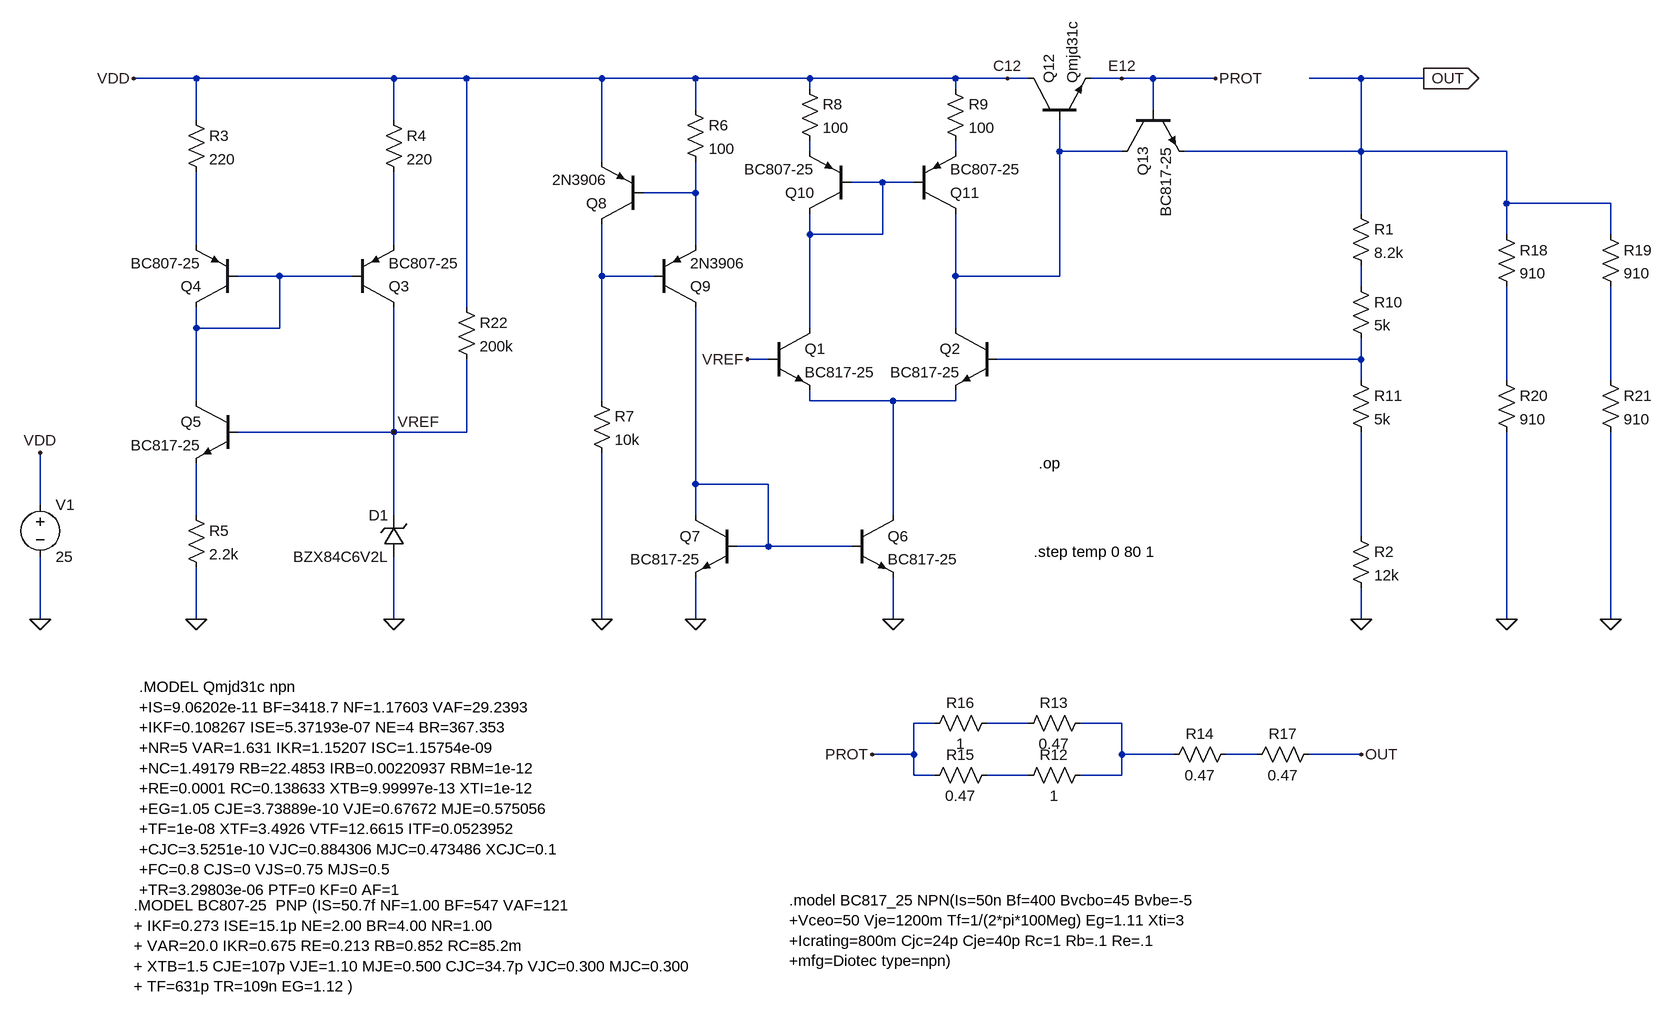
[diagram p0: schematic THERMAL_DRIFT.asc]
THERMAL_DRIFT.asc, the LTspice schematic file:
Version 4
SHEET 1 1236 776
WIRE -1008 -624 -1104 -624
WIRE -704 -624 -1008 -624
WIRE -592 -624 -704 -624
WIRE -384 -624 -592 -624
WIRE -240 -624 -384 -624
WIRE -64 -624 -240 -624
WIRE 160 -624 -64 -624
WIRE 240 -624 160 -624
WIRE 272 -624 240 -624
WIRE 416 -624 368 -624
WIRE 464 -624 416 -624
WIRE 560 -624 464 -624
WIRE 784 -624 704 -624
WIRE 880 -624 784 -624
WIRE -64 -608 -64 -624
WIRE 160 -608 160 -624
WIRE -240 -576 -240 -624
WIRE 464 -576 464 -624
WIRE -1008 -560 -1008 -624
WIRE -704 -560 -704 -624
WIRE -64 -512 -64 -528
WIRE 160 -512 160 -528
WIRE 320 -512 320 -560
WIRE 416 -512 320 -512
WIRE 784 -512 784 -624
WIRE 784 -512 512 -512
WIRE 1008 -512 784 -512
WIRE -384 -496 -384 -624
WIRE 48 -464 0 -464
WIRE 96 -464 48 -464
WIRE -240 -448 -240 -496
WIRE -240 -448 -320 -448
WIRE 1008 -432 1008 -512
WIRE 1168 -432 1008 -432
WIRE 784 -416 784 -512
WIRE -64 -384 -64 -416
WIRE 48 -384 48 -464
WIRE 48 -384 -64 -384
WIRE 1008 -384 1008 -432
WIRE 1168 -384 1168 -432
WIRE -1008 -368 -1008 -480
WIRE -704 -368 -704 -480
WIRE -240 -368 -240 -448
WIRE -880 -320 -944 -320
WIRE -768 -320 -880 -320
WIRE -384 -320 -384 -400
WIRE -304 -320 -384 -320
WIRE 160 -320 160 -416
WIRE 320 -320 320 -512
WIRE 320 -320 160 -320
WIRE 784 -304 784 -336
WIRE -592 -272 -592 -624
WIRE -1008 -240 -1008 -272
WIRE -880 -240 -880 -320
WIRE -880 -240 -1008 -240
WIRE -64 -240 -64 -384
WIRE 160 -240 160 -320
WIRE -128 -192 -160 -192
WIRE 784 -192 784 -224
WIRE 784 -192 224 -192
WIRE 784 -160 784 -192
WIRE 1008 -160 1008 -304
WIRE 1168 -160 1168 -304
WIRE -1008 -128 -1008 -240
WIRE -384 -128 -384 -320
WIRE -64 -128 -64 -144
WIRE 64 -128 -64 -128
WIRE 160 -128 160 -144
WIRE 160 -128 64 -128
WIRE -704 -80 -704 -272
WIRE -704 -80 -944 -80
WIRE -592 -80 -592 -192
WIRE -592 -80 -704 -80
WIRE -240 0 -240 -272
WIRE -128 0 -240 0
WIRE -1248 32 -1248 -48
WIRE -1008 48 -1008 -32
WIRE -704 48 -704 -80
WIRE -240 48 -240 0
WIRE 64 48 64 -128
WIRE 784 80 784 -80
WIRE -128 96 -128 0
WIRE -128 96 -176 96
WIRE 0 96 -128 96
WIRE -1248 208 -1248 112
WIRE -1008 208 -1008 128
WIRE -704 208 -704 112
WIRE -384 208 -384 -48
WIRE -240 208 -240 144
WIRE 64 208 64 144
WIRE 784 208 784 160
WIRE 1008 208 1008 -80
WIRE 1168 208 1168 -80
WIRE 128 368 96 368
WIRE 272 368 208 368
WIRE 416 368 352 368
WIRE 96 416 96 368
WIRE 96 416 32 416
WIRE 416 416 416 368
WIRE 496 416 416 416
WIRE 624 416 576 416
WIRE 784 416 704 416
WIRE 96 448 96 416
WIRE 128 448 96 448
WIRE 272 448 208 448
WIRE 416 448 416 416
WIRE 416 448 352 448
FLAG 784 208 0
FLAG -1008 208 0
FLAG 64 208 0
FLAG -240 208 0
FLAG -384 208 0
FLAG -160 -192 VREF
FLAG 880 -624 OUT
IOPIN 880 -624 Out
FLAG 240 -624 C12
FLAG 416 -624 E12
FLAG -1248 208 0
FLAG 560 -624 PROT
FLAG 32 416 PROT
FLAG 784 416 OUT
FLAG -1248 -48 VDD
FLAG -1104 -624 VDD
FLAG -704 208 0
FLAG -704 -80 VREF
FLAG 1008 208 0
FLAG 1168 208 0
SYMBOL npn -128 -240 R0
SYMATTR InstName Q1
SYMATTR Value BC817-25
SYMBOL npn 224 -240 M0
SYMATTR InstName Q2
SYMATTR Value BC817-25
SYMBOL res 768 -432 R0
SYMATTR InstName R1
SYMATTR Value 8.2k
SYMBOL res 768 64 R0
SYMATTR InstName R2
SYMATTR Value 12k
SYMBOL pnp -768 -272 M180
SYMATTR InstName Q3
SYMATTR Value BC807-25
SYMBOL pnp -944 -272 R180
SYMATTR InstName Q4
SYMATTR Value BC807-25
SYMBOL npn -944 -128 M0
SYMATTR InstName Q5
SYMATTR Value BC817-25
SYMBOL res -1024 -576 R0
SYMATTR InstName R3
SYMATTR Value 220
SYMBOL res -720 -576 R0
SYMATTR InstName R4
SYMATTR Value 220
SYMBOL res -1024 32 R0
SYMATTR InstName R5
SYMATTR Value 2.2k
SYMBOL npn 0 48 R0
SYMATTR InstName Q6
SYMATTR Value BC817-25
SYMBOL npn -176 48 M0
SYMATTR InstName Q7
SYMATTR Value BC817-25
SYMBOL pnp -320 -400 R180
SYMATTR InstName Q8
SYMATTR Value 2N3906
SYMBOL pnp -304 -272 M180
SYMATTR InstName Q9
SYMATTR Value 2N3906
SYMBOL res -256 -592 R0
SYMATTR InstName R6
SYMATTR Value 100
SYMBOL res -400 -144 R0
SYMATTR InstName R7
SYMATTR Value 10k
SYMBOL pnp 0 -416 R180
SYMATTR InstName Q10
SYMATTR Value BC807-25
SYMBOL pnp 96 -416 M180
SYMATTR InstName Q11
SYMATTR Value BC807-25
SYMBOL npn 272 -560 R270
SYMATTR InstName Q12
SYMATTR Value Qmjd31c
SYMBOL res -80 -624 R0
SYMATTR InstName R8
SYMATTR Value 100
SYMBOL res 144 -624 R0
SYMATTR InstName R9
SYMATTR Value 100
SYMBOL npn 416 -576 M90
SYMATTR InstName Q13
SYMATTR Value BC817-25
SYMBOL res 768 -320 R0
SYMATTR InstName R10
SYMATTR Value 5k
SYMBOL res 768 -176 R0
SYMATTR InstName R11
SYMATTR Value 5k
SYMBOL res 368 432 R90
WINDOW 0 0 56 VBottom 2
WINDOW 3 32 56 VTop 2
SYMATTR InstName R12
SYMATTR Value 1
SYMBOL res 368 352 R90
WINDOW 0 0 56 VBottom 2
WINDOW 3 32 56 VTop 2
SYMATTR InstName R13
SYMATTR Value 0.47
SYMBOL res 592 400 R90
WINDOW 0 0 56 VBottom 2
WINDOW 3 32 56 VTop 2
SYMATTR InstName R14
SYMATTR Value 0.47
SYMBOL res 224 432 R90
WINDOW 0 0 56 VBottom 2
WINDOW 3 32 56 VTop 2
SYMATTR InstName R15
SYMATTR Value 0.47
SYMBOL res 224 352 R90
WINDOW 0 0 56 VBottom 2
WINDOW 3 32 56 VTop 2
SYMATTR InstName R16
SYMATTR Value 1
SYMBOL res 720 400 R90
WINDOW 0 0 56 VBottom 2
WINDOW 3 32 56 VTop 2
SYMATTR InstName R17
SYMATTR Value 0.47
SYMBOL zener -688 112 R180
WINDOW 0 24 64 Left 2
WINDOW 3 24 0 Left 2
SYMATTR InstName D1
SYMATTR Value BZX84C6V2L
SYMBOL voltage -1248 16 R0
WINDOW 123 0 0 Left 0
WINDOW 39 0 0 Left 0
SYMATTR InstName V1
SYMATTR Value 25
SYMBOL res 992 -400 R0
SYMATTR InstName R18
SYMATTR Value 910
SYMBOL res 1152 -400 R0
SYMATTR InstName R19
SYMATTR Value 910
SYMBOL res 992 -176 R0
SYMATTR InstName R20
SYMATTR Value 910
SYMBOL res 1152 -176 R0
SYMATTR InstName R21
SYMATTR Value 910
SYMBOL res -608 -288 R0
SYMATTR InstName R22
SYMATTR Value 200k
TEXT -96 640 Left 2 !.model BC817_25 NPN(Is=50n Bf=400 Bvcbo=45 Bvbe=-5\n+Vceo=50 Vje=1200m Tf=1/(2*pi*100Meg) Eg=1.11 Xti=3\n+Icrating=800m Cjc=24p Cje=40p Rc=1 Rb=.1 Re=.1\n+mfg=Diotec type=npn)
TEXT -1096 312 Left 2 !.MODEL Qmjd31c npn\n+IS=9.06202e-11 BF=3418.7 NF=1.17603 VAF=29.2393\n+IKF=0.108267 ISE=5.37193e-07 NE=4 BR=367.353\n+NR=5 VAR=1.631 IKR=1.15207 ISC=1.15754e-09\n+NC=1.49179 RB=22.4853 IRB=0.00220937 RBM=1e-12\n+RE=0.0001 RC=0.138633 XTB=9.99997e-13 XTI=1e-12\n+EG=1.05 CJE=3.73889e-10 VJE=0.67672 MJE=0.575056\n+TF=1e-08 XTF=3.4926 VTF=12.6615 ITF=0.0523952\n+CJC=3.5251e-10 VJC=0.884306 MJC=0.473486 XCJC=0.1\n+FC=0.8 CJS=0 VJS=0.75 MJS=0.5\n+TR=3.29803e-06 PTF=0 KF=0 AF=1
TEXT -1104 648 Left 2 !.MODEL BC807-25  PNP (IS=50.7f NF=1.00 BF=547 VAF=121\n+ IKF=0.273 ISE=15.1p NE=2.00 BR=4.00 NR=1.00\n+ VAR=20.0 IKR=0.675 RE=0.213 RB=0.852 RC=85.2m\n+ XTB=1.5 CJE=107p VJE=1.10 MJE=0.500 CJC=34.7p VJC=0.300 MJC=0.300 \n+ TF=631p TR=109n EG=1.12 )
TEXT 280 104 Left 2 !.step temp 0 80 1
TEXT 288 -32 Left 2 !.op

The netlist it stands for:
* THERMAL_DRIFT.asc
Q1 N004 VREF N014 0 BC817-25
Q2 N003 N011 N014 0 BC817-25
R1 OUT N010 8.2k
R2 N017 0 12k
Q3 VREF N008 N007 0 BC807-25
Q4 N008 N008 N006 0 BC807-25
Q5 N008 VREF N016 0 BC817-25
R3 VDD N006 220
R4 VDD N007 220
R5 N016 0 2.2k
Q6 N014 N015 0 0 BC817-25
Q7 N015 N015 0 0 BC817-25
Q8 N009 N005 VDD 0 2N3906
Q9 N015 N009 N005 0 2N3906
R6 VDD N005 100
R7 N009 0 10k
Q10 N004 N004 N001 0 BC807-25
Q11 N003 N004 N002 0 BC807-25
Q12 VDD N003 PROT 0 Qmjd31c
R8 VDD N001 100
R9 VDD N002 100
Q13 N003 PROT OUT 0 BC817-25
R10 N010 N011 5k
R11 N011 N017 5k
R12 N019 N021 1
R13 N019 N018 0.47
R14 N020 N019 0.47
R15 N021 PROT 0.47
R16 N018 PROT 1
R17 OUT N020 0.47
D1 0 VREF BZX84C6V2L
V1 VDD 0 25
R18 OUT N012 910
R19 OUT N013 910
R20 N012 0 910
R21 N013 0 910
R22 VDD VREF 200k
.model D D
.lib standard.dio
.model NPN NPN
.model PNP PNP
.lib standard.bjt
.model BC817_25 NPN(Is=50n Bf=400 Bvcbo=45 Bvbe=-5
+Vceo=50 Vje=1200m Tf=1/(2*pi*100Meg) Eg=1.11 Xti=3
+Icrating=800m Cjc=24p Cje=40p Rc=1 Rb=.1 Re=.1
+mfg=Diotec type=npn)
.MODEL Qmjd31c npn
+IS=9.06202e-11 BF=3418.7 NF=1.17603 VAF=29.2393
+IKF=0.108267 ISE=5.37193e-07 NE=4 BR=367.353
+NR=5 VAR=1.631 IKR=1.15207 ISC=1.15754e-09
+NC=1.49179 RB=22.4853 IRB=0.00220937 RBM=1e-12
+RE=0.0001 RC=0.138633 XTB=9.99997e-13 XTI=1e-12
+EG=1.05 CJE=3.73889e-10 VJE=0.67672 MJE=0.575056
+TF=1e-08 XTF=3.4926 VTF=12.6615 ITF=0.0523952
+CJC=3.5251e-10 VJC=0.884306 MJC=0.473486 XCJC=0.1
+FC=0.8 CJS=0 VJS=0.75 MJS=0.5
+TR=3.29803e-06 PTF=0 KF=0 AF=1
.MODEL BC807-25  PNP (IS=50.7f NF=1.00 BF=547 VAF=121
+ IKF=0.273 ISE=15.1p NE=2.00 BR=4.00 NR=1.00
+ VAR=20.0 IKR=0.675 RE=0.213 RB=0.852 RC=85.2m
+ XTB=1.5 CJE=107p VJE=1.10 MJE=0.500 CJC=34.7p VJC=0.300 MJC=0.300
+ TF=631p TR=109n EG=1.12 )
.step temp 0 80 1
.op
.backanno
.end